# Altium project Pin28_DIP.PrjPcb (part 1 of 3)
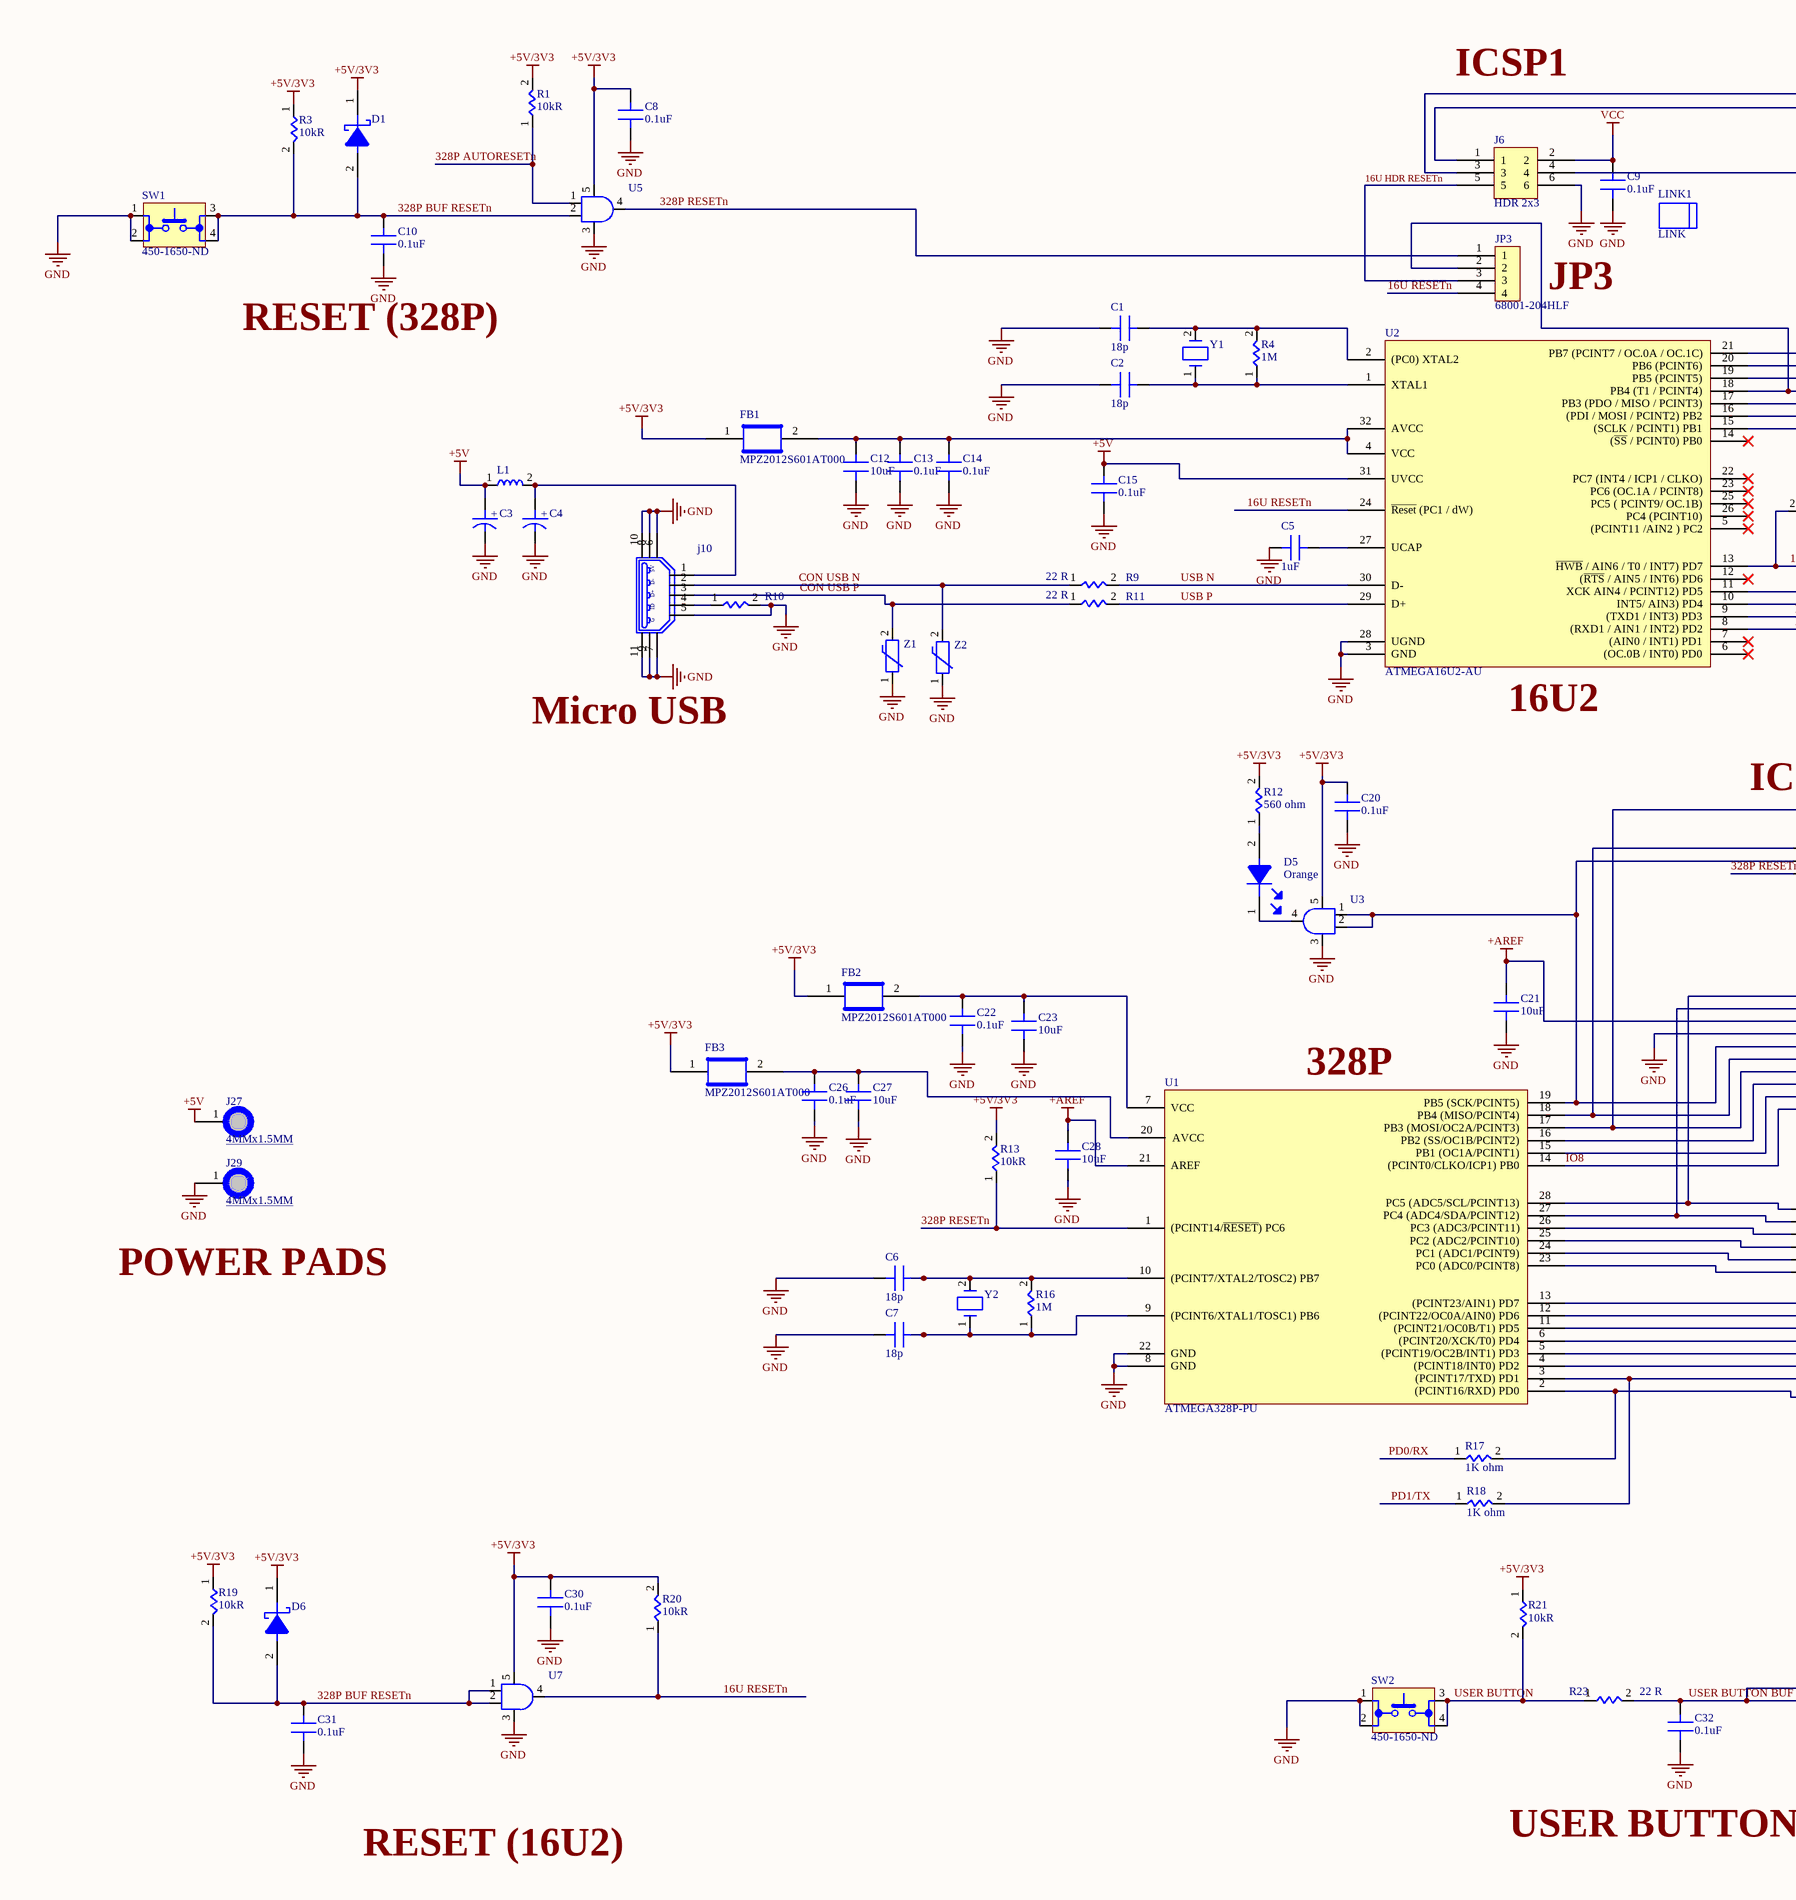
[diagram p0: Pin28_Schematic.SchDoc, left]
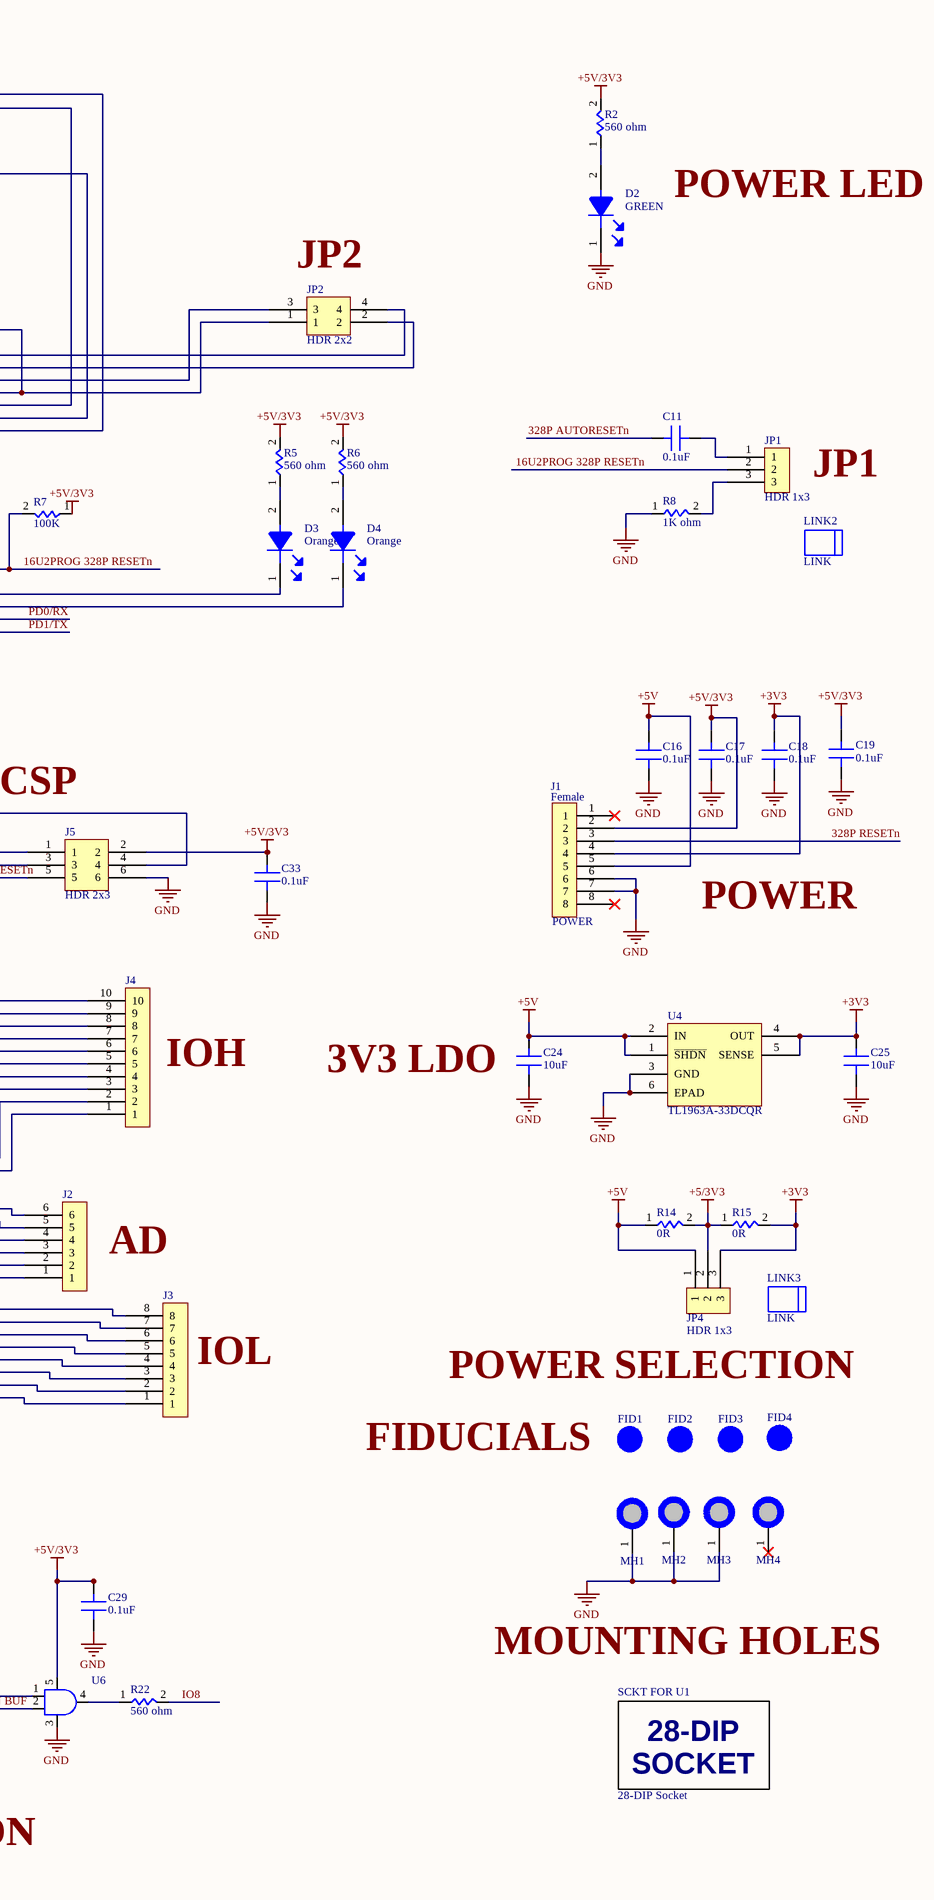
[diagram p1: Pin28_Schematic.SchDoc, right]
NotFitted: NF; Title: Arduino_Uno_Mod
1 sheet, 104 parts. Net scope: global (net labels, ports and power ports of the same name join across sheets).
Board file: Pin28_PCB.PcbDoc

## Sheet Pin28_Schematic.SchDoc: Arduino_Uno_Mod
size A2

### Parts
C1  18p  [C0805 0.1 UF Footprint]
C2  18p  [C0805 0.1 UF Footprint]
C3  EEE-1AA101WR  [C_ALU_C_SIZE]  (value not drawn)
C4  EEE-1AA101WR  [C_ALU_C_SIZE]  (value not drawn)
C5  1uF  [C0805 10 uF Footprint]
C6  18p  [C0805 0.1 UF Footprint]
C7  18p  [C0805 0.1 UF Footprint]
C8  0.1uF  [C0805 0.1 UF Footprint]
C9  0.1uF  [C0805 0.1 UF Footprint]
C10  0.1uF  [C0805 0.1 UF Footprint]
C11  0.1uF  [C0805 0.1 UF Footprint]
C12  10uF  [C0805 10 uF Footprint]
C13  0.1uF  [C0805 0.1 UF Footprint]
C14  0.1uF  [C0805 0.1 UF Footprint]
C15  0.1uF  [C0805 0.1 UF Footprint]
C16  0.1uF  [C0805 0.1 UF Footprint]
C17  0.1uF  [C0805 0.1 UF Footprint]
C18  0.1uF  [C0805 0.1 UF Footprint]
C19  0.1uF  [C0805 0.1 UF Footprint]
C20  0.1uF  [C0805 0.1 UF Footprint]
C21  10uF  [C0805 10 uF Footprint]
C22  0.1uF  [C0805 0.1 UF Footprint]
C23  10uF  [C0805 10 uF Footprint]
C24  10uF  [C0805 10 uF Footprint]
C25  10uF  [C0805 10 uF Footprint]
C26  0.1uF  [C0805 0.1 UF Footprint]
C27  10uF  [C0805 10 uF Footprint]
C28  10uF  [C0805 10 uF Footprint]
C29  0.1uF  [C0805 0.1 UF Footprint]
C30  0.1uF  [C0805 0.1 UF Footprint]
C31  0.1uF  [C0805 0.1 UF Footprint]
C32  0.1uF  [C0805 0.1 UF Footprint]
C33  0.1uF  [C0805 0.1 UF Footprint]
D1  BAT54HT1G  [SOD323]  (value not drawn)
D2  GREEN  [LED_0603]
D3  Orange  [LED_0603]
D4  Orange  [LED_0603]
D5  Orange  [LED_0603]
D6  BAT54HT1G  [SOD323]  (value not drawn)
FB1  MPZ2012S601AT000  [C0805 0.1 UF Footprint]
FB2  MPZ2012S601AT000  [C0805 0.1 UF Footprint]
FB3  MPZ2012S601AT000  [C0805 0.1 UF Footprint]
FID1  FID_1MM  [FID_40x120]  (value not drawn)  (no BOM)
FID2  FID_1MM  [FID_40x120]  (value not drawn)  (no BOM)
FID3  FID_1MM  [FID_40x120]  (value not drawn)  (no BOM)
FID4  FID_1MM  [FID_40x120]  (value not drawn)  (no BOM)
J1  POWER  Contact Gender: Female  [Header Female 8 2.54 mm]
J2  M20-7820646  [Header Female 6 2.54 mm]  (value not drawn)
J3  08 contacts 2.54mm (0.1") Pitch SIL Vertical PC Tail Socket Assembly, selective gold + tin  [Header Female 8 2.54 mm]  (value not drawn)
J4  10 contacts - M20-7821046 - Board-To-Board Connector, M20 Series, Through Hole, Receptacle, 10, 2.54 mm, Tin Plated Contacts  [Header Female 10 2.54 mm]  (value not drawn)
J5  HDR 2x3  [HDR 2x3 2.54mm]
J6  HDR 2x3  [HDR 2x3 2.54mm]
j10  10118193-0001LF  [10118193]  (value not drawn)
J27  4MMx1.5MM  [PAD_4MMx1.5MM]  (no BOM)
J29  4MMx1.5MM  [PAD_4MMx1.5MM]  (no BOM)
JP1  HDR 1x3  [Header Male HDR 1x3 2.54 mm]
JP2  HDR 2x2  [HDR 2x2 2.54mm]
JP3  68001-204HLF  [Header MALE HDR 1x4 2.54 mm]
JP4  HDR 1x3  [Header Male HDR 1x3 2.54 mm]
L1  L1210R2R2MDWIT  [C1210_IND]  (value not drawn)
LINK1  LINK  (mechanical)
LINK2  LINK  (mechanical)
LINK3  LINK  (mechanical)
MH1  MH7.4MMc_3.2MMD  [MH7.4MMD_3.2MMD]  (value not drawn)  (no BOM)
MH2  MH7.4MMc_3.2MMD  [MH7.4MMD_3.2MMD]  (value not drawn)  (no BOM)
MH3  MH7.4MMc_3.2MMD  [MH7.4MMD_3.2MMD]  (value not drawn)  (no BOM)
MH4  MH_7.4MMNC_3.2MMD  [MH_7.4MMND_3.2MMD_NON_COPPER]  (value not drawn)  (no BOM)
R1  Resistance: 10kR  [R0805 1K]  (hidden comment: RC0805FR-0710KL)
R2  560 ohm  [R0805 1K]
R3  Resistance: 10kR  [R0805 1K]  (hidden comment: RC0805FR-0710KL)
R4  1M  [R0805 1M]
R5  560 ohm  [R0805 1K]
R6  560 ohm  [R0805 1K]
R7  100K  [R0805 1K]
R8  1K ohm  [R0805 1M]
R9  22 R  [R0805 1K]
R10  0R/RC0805JR-070RL  [R0805 1K]  (value not drawn)
R11  22 R  [R0805 1K]
R12  560 ohm  [R0805 1K]
R13  Resistance: 10kR  [R0805 1K]  (hidden comment: RC0805FR-0710KL)
R14  0R  [R0805 1K]
R15  0R  [R0805 1K]
R16  1M  [R0805 1M]
R17  1K ohm  [R0805 1M]
R18  1K ohm  [R0805 1M]
R19  Resistance: 10kR  [R0805 1K]  (hidden comment: RC0805FR-0710KL)
R20  Resistance: 10kR  [R0805 1K]  (hidden comment: RC0805FR-0710KL)
R21  Resistance: 10kR  [R0805 1K]  (hidden comment: RC0805FR-0710KL)
R22  560 ohm  [R0805 1K]
R23  22 R  [R0805 1K]
SCKT_FOR_U1  28-DIP Socket  [28-DIP, 7.6mm Socket]
SW1  450-1650-ND  [1825910-6]
SW2  450-1650-ND  [1825910-6]
U1  ATMEGA328P-PU  [DIP28]
U2  ATMEGA16U2-AU  [TQFP32]
U3  SN74AHC1G09DBVR  [DBV_SOT_23_5]  (value not drawn)
U4  TL1963A-33DCQR  [DCQ (R-PDSO-G6)]
U5  SN74AHC1G09DBVR  [DBV_SOT_23_5]  (value not drawn)
U6  SN74AHC1G09DBVR  [DBV_SOT_23_5]  (value not drawn)
U7  SN74AHC1G09DBVR  [DBV_SOT_23_5]  (value not drawn)
Y1  M7-16.000MHZ-D2Y-T  [Crystal 16Mhz]  (value not drawn)
Y2  M7-16.000MHZ-D2Y-T  [Crystal 16Mhz]  (value not drawn)
Z1  CG0603MLC-05E  [R0603]  (value not drawn)
Z2  CG0603MLC-05E  [R0603]  (value not drawn)

### Nets
+3V3: C18.2 C25.2 J1.4 JP4.3 R15.2 U4.4(OUT) U4.5(SENSE)
+5/3V3: JP4.2 R14.2 R15.1
+5V: C3.1 C15.2 C16.2 C24.2 J1.5 J27.1 JP4.1 L1.1 R14.1 U2.31(UVCC) U4.1(~{SHDN}) U4.2(IN)
+5V/3V3: C8.2 C17.2 C19.2 C20.2 C29.2 C30.2 C33.2 D1.1(cathod) D6.1(cathod) FB1.1 FB2.1 FB3.1 J1.2 J5.2 R1.2 R2.2 R3.1 R5.2 R6.2 R7.1 R12.2 R13.2 R19.1 R20.2 R21.1 U3.5 U5.5 U6.5 U7.5
+AREF: C21.2 C28.2 J4.8 U1.21(AREF)
GND: C1.1 C2.1 C3.2 C4.2 C5.1 C6.1 C7.1 C8.1 C9.1 C10.1 C12.1 C13.1 C14.1 C15.1 C16.1 C17.1 C18.1 C19.1 C20.1 C21.1 C22.1 C23.1 C24.1 C25.1 C26.1 C27.1 C28.1 C29.1 C30.1 C31.1 C32.1 C33.1 D2.1(cathod) J1.6 J1.7 J4.7 J5.6 J6.6 j10.5 j10.6 j10.7 j10.8 j10.9 j10.10 j10.11 J29.1 MH1.1 MH2.1 MH3.1 R8.1 R10.2 SW1.1 SW1.2 SW2.1 SW2.2 U1.8(GND) U1.22(GND) U2.3(GND) U2.28(UGND) U3.3 U4.3(GND) U4.6(EPAD) U5.3 U6.3 U7.3 Z1.1 Z2.1
VCC: C9.2 J6.2
16U2PROG 328P RESETn: JP1.2 R7.2 U2.13(~{HWB}_/_AIN6_/_T0_/_INT7)_PD7)
16U HDR RESETn: J6.5 JP3.3
16U RESETn: JP3.4 R20.1 U2.24(~{Reset}_(PC1_/_dW)) U7.4
328P AUTORESETn: C11.2 R1.1 U5.1
328P BUF RESETn: C10.2 C31.2 D1.2(anode) D6.2(anode) R3.2 R19.2 SW1.3 SW1.4 U5.2 U7.1 U7.2
328P RESETn: J1.3 J5.5 JP3.1 R13.1 U1.1((PCINT14/~{RESET})_PC6) U5.4
CON USB N: j10.2 R9.1 Z2.2
CON USB P: j10.3 R11.1 Z1.2
IO8: J4.1 R22.2 U1.14((PCINT0/CLKO/ICP1)_PB0)
PD0/RX: R17.1 U2.9((TXD1_/_INT3)_PD3)
PD1/TX: R18.1 U2.8((RXD1_/_AIN1_/_INT2)_PD2)
USB N: R9.2 U2.30(D-)
USB P: R11.2 U2.29(D+)
USER BUTTON: R21.2 R23.1 SW2.3 SW2.4
USER BUTTON BUF: C32.2 R23.2 U6.1 U6.2
NetC1_2: C1.2 R4.2 U2.2((PC0)_XTAL2) Y1.2
NetC2_2: C2.2 R4.1 U2.1(XTAL1) Y1.1
NetC4_1: C4.1 j10.1 L1.2
NetC5_2: C5.2 U2.27(UCAP)
NetC6_2: C6.2 R16.2 U1.10((PCINT7/XTAL2/TOSC2)_PB7) Y2.2
NetC7_2: C7.2 R16.1 U1.9((PCINT6/XTAL1/TOSC1)_PB6) Y2.1
NetC11_1: C11.1 JP1.1
NetC12_2: C12.2 C13.2 C14.2 FB1.2 U2.4(VCC) U2.32(AVCC)
NetC22_2: C22.2 C23.2 FB2.2 U1.7(VCC)
NetC26_2: C26.2 C27.2 FB3.2 U1.20(AVCC)
NetD2_2: D2.2(anode) R2.1
NetD3_1: D3.1(cathod) U2.11(XCK_AIN4_/_PCINT12)_PD5)
NetD3_2: D3.2(anode) R5.1
NetD4_1: D4.1(cathod) U2.10(INT5/_AIN3)_PD4)
NetD4_2: D4.2(anode) R6.1
NetD5_1: D5.1(cathod) U3.4
NetD5_2: D5.2(anode) R12.1
NetJ2_1: J2.1 U1.23(PC0_(ADC0/PCINT8))
NetJ2_2: J2.2 U1.24(PC1_(ADC1/PCINT9))
NetJ2_3: J2.3 U1.25(PC2_(ADC2/PCINT10))
NetJ2_4: J2.4 U1.26(PC3_(ADC3/PCINT11))
NetJ2_5: J2.5 J4.9 U1.27(PC4_(ADC4/SDA/PCINT12))
NetJ2_6: J2.6 J4.10 U1.28(PC5_(ADC5/SCL/PCINT13))
NetJ3_1: J3.1 R17.2 U1.2((PCINT16/RXD)_PD0)
NetJ3_2: J3.2 R18.2 U1.3((PCINT17/TXD)_PD1)
NetJ3_3: J3.3 U1.4((PCINT18/INT0)_PD2)
NetJ3_4: J3.4 U1.5((PCINT19/OC2B/INT1)_PD3)
NetJ3_5: J3.5 U1.6((PCINT20/XCK/T0)_PD4)
NetJ3_6: J3.6 U1.11((PCINT21/OC0B/T1)_PD5)
NetJ3_7: J3.7 U1.12((PCINT22/OC0A/AIN0)_PD6)
NetJ3_8: J3.8 U1.13((PCINT23/AIN1)_PD7)
NetJ4_2: J4.2 U1.15(PB1_(OC1A/PCINT1))
NetJ4_3: J4.3 U1.16(PB2_(SS/OC1B/PCINT2))
NetJ4_4: J4.4 J5.4 U1.17(PB3_(MOSI/OC2A/PCINT3))
NetJ4_5: J4.5 J5.1 U1.18(PB4_(MISO/PCINT4))
NetJ4_6: J4.6 J5.3 U1.19(PB5_(SCK/PCINT5)) U3.1 U3.2
NetJ6_1: J6.1 U2.17(PB3_(PDO_/_MISO_/_PCINT3))
NetJ6_3: J6.3 U2.15((SCLK_/_PCINT1)_PB1)
NetJ6_4: J6.4 U2.16((PDI_/_MOSI_/_PCINT2)_PB2)
Netj10_4: j10.4 R10.1
NetJP1_3: JP1.3 R8.2
NetJP2_1: JP2.1 JP3.2 U2.18(PB4_(T1_/_PCINT4))
NetJP2_2: JP2.2 U2.20(PB6_(PCINT6))
NetJP2_3: JP2.3 U2.19(PB5_(PCINT5))
NetJP2_4: JP2.4 U2.21(PB7_(PCINT7_/_OC.0A_/_OC.1C))
NetR22_1: R22.1 U6.4

Not connected (* = marked no-connect by the designer): J1 1* 8*; MH4 1*; U2 5((PCINT11_/AIN2_)_PC2)* 6((OC.0B_/_INT0)_PD0)* 7((AIN0_/_INT1)_PD1)* 12((~{RTS}_/_AIN5_/_INT6)_PD6)* 14((~{SS}_/_PCINT0)_PB0)* 22(PC7_(INT4_/_ICP1_/_CLKO))* 23(PC6_(OC.1A_/_PCINT8))* 25(PC5_(_PCINT9/_OC.1B))* 26(PC4_(PCINT10))*

### Notes on the sheet
- ICSP1
- POWER LED
- (near JP2) JP2
- RESET (328P)
- JP3
- JP1
- Micro USB
- (near U2) 16U2
- (near J5) ICSP
- POWER
- (near U1) 328P
- (near J4) IOH
- 3V3 LDO
- POWER PADS
- AD
- (near J3) IOL
- POWER SELECTION
- FIDUCIALS
- (near SCKT_FOR_U1) MOUNTING HOLES
- USER BUTTON
- RESET (16U2)
- (in symbol 4828-3004-CP) 28-DIP; SOCKET
- (in symbol 10118193-0001LF) 5V; D-; D+; ID; G
- (in symbol EEE-1AA101WR) +